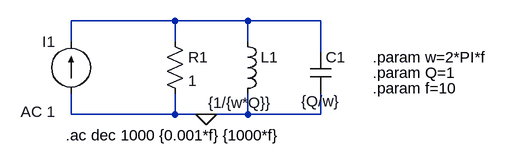
[diagram p0: schematic Circuito RLC paralelo.asc]
Circuito RLC paralelo.asc, the LTspice schematic file:
Version 4
SHEET 1 960 680
WIRE 208 80 48 80
WIRE 320 80 208 80
WIRE 432 80 320 80
WIRE 48 112 48 80
WIRE 208 112 208 80
WIRE 320 112 320 80
WIRE 432 128 432 80
WIRE 48 224 48 192
WIRE 208 224 208 192
WIRE 208 224 48 224
WIRE 256 224 208 224
WIRE 320 224 320 192
WIRE 320 224 256 224
WIRE 432 224 432 192
WIRE 432 224 320 224
FLAG 256 224 0
SYMBOL res 192 96 R0
SYMATTR InstName R1
SYMATTR Value 1
SYMBOL ind 304 96 R0
WINDOW 3 -45 110 Left 2
SYMATTR InstName L1
SYMATTR Value {1/{w*Q}}
SYMBOL cap 416 128 R0
WINDOW 3 -14 76 Left 2
SYMATTR InstName C1
SYMATTR Value {Q/w}
SYMBOL current 48 192 R180
WINDOW 0 24 80 Left 2
WINDOW 3 24 0 Left 2
WINDOW 123 24 -28 Left 2
WINDOW 39 0 0 Left 0
SYMATTR InstName I1
SYMATTR Value ""
SYMATTR Value2 AC 1
TEXT 40 256 Left 2 !.ac dec 1000 {0.001*f} {1000*f}
TEXT 512 160 Left 2 !.param Q=1
TEXT 512 136 Left 2 !.param w=2*PI*f
TEXT 512 184 Left 2 !.param f=10

The netlist it stands for:
* Circuito RLC paralelo.asc
R1 N001 0 1
L1 N001 0 {1/{w*Q}}
C1 N001 0 {Q/w}
I1 0 N001 AC 1
.ac dec 1000 {0.001*f} {1000*f}
.param Q=1
.param w=2*PI*f
.param f=10
.backanno
.end